# Altium schematic sheet QCopterCAM_POWER_Sch.SchDoc
size A4
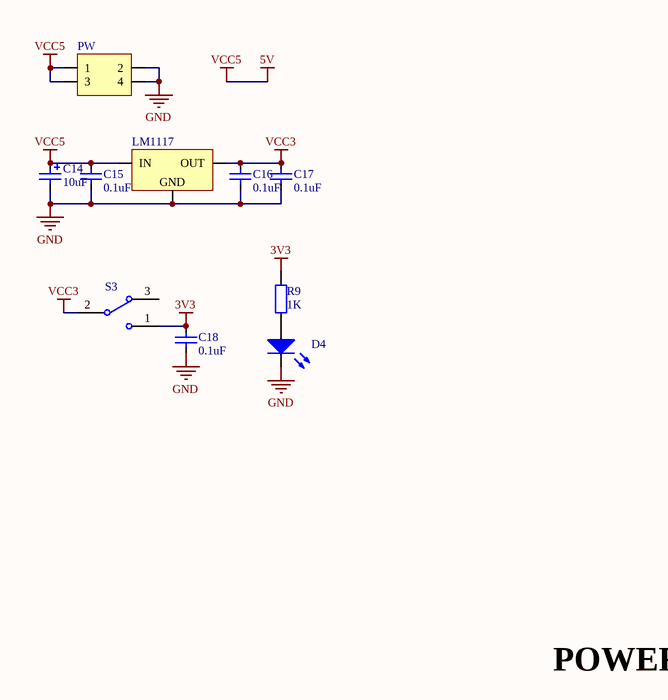
[diagram p0: QCopterCAM_POWER_Sch.SchDoc]

## Parts
C14  value 10uF  [CAP_TAN_B1210]  (hidden comment: Cap_Tan_1210)
C15  value 0.1uF  [CAP_0603]  (hidden comment: Cap_0603)
C16  value 0.1uF  [CAP_0603]  (hidden comment: Cap_0603)
C17  value 0.1uF  [CAP_0603]  (hidden comment: Cap_0603)
C18  value 0.1uF  [CAP_0603]  (hidden comment: Cap_0603)
D4  LED_0603_BLUE  [LED_0603_BLUE]  (value not drawn)
LM1  LM1117  [SOT223]
PW  HDR2X2_90_2.54  [HDR2X2_90_2.54]  (value not drawn)
R9  value 1K  [RES_0603]  (hidden comment: Res_0603)
S3  SW-SPDT  [SW_T]  (value not drawn)

## Nets
3V3: C18.2 R9.2 S3.1
5V: C14.1 C15.2 LM1.3(IN) PW.1 PW.3  [also labelled VCC5]
GND: C14.2 C15.1 C16.1 C17.1 C18.1 D4.2(K) LM1.1(GND) PW.2 PW.4
VCC3: C16.2 C17.2 LM1.2(OUT) S3.2
NetD4_1: D4.1(A) R9.1

Not connected (* = marked no-connect by the designer): S3 3

## Notes on the sheet
- POWER

## Library data of the parts
C14 = Cap_Tan_1210: Capacitor
C15-C18 = Cap_0603: Capacitor
D4 = LED_0603_BLUE: LED
LM1 = LM1117: Power
PW = HDR2X2_90_2.54: Header
R9 = Res_0603: Resistor
S3 = SW-SPDT_1: SPDT Subminiature Toggle Switch, Right Angle Mounting, Vertical Actuation; Published: 24-Mar-1999; LatestRevisionDate: 17-Dec-2003; LatestRevisionNote: Schematic revised, PCB Footprint replaced.; DatasheetVersion: 05-Dec-2000; PackageReference: TL36WW15050; Publisher: Altium Limited; PackageDescription: Switch; 4 Leads; ComponentLink1Description: Manufacturer Link; ComponentLink1URL: http://www.apem.com